# Altium schematic sheet MainBoard_ETH.SchDoc
size 840 x 594 mm; DocumentNumber: VSL.23-MOTHERBOARD; SheetNumber: 3; Format: A1
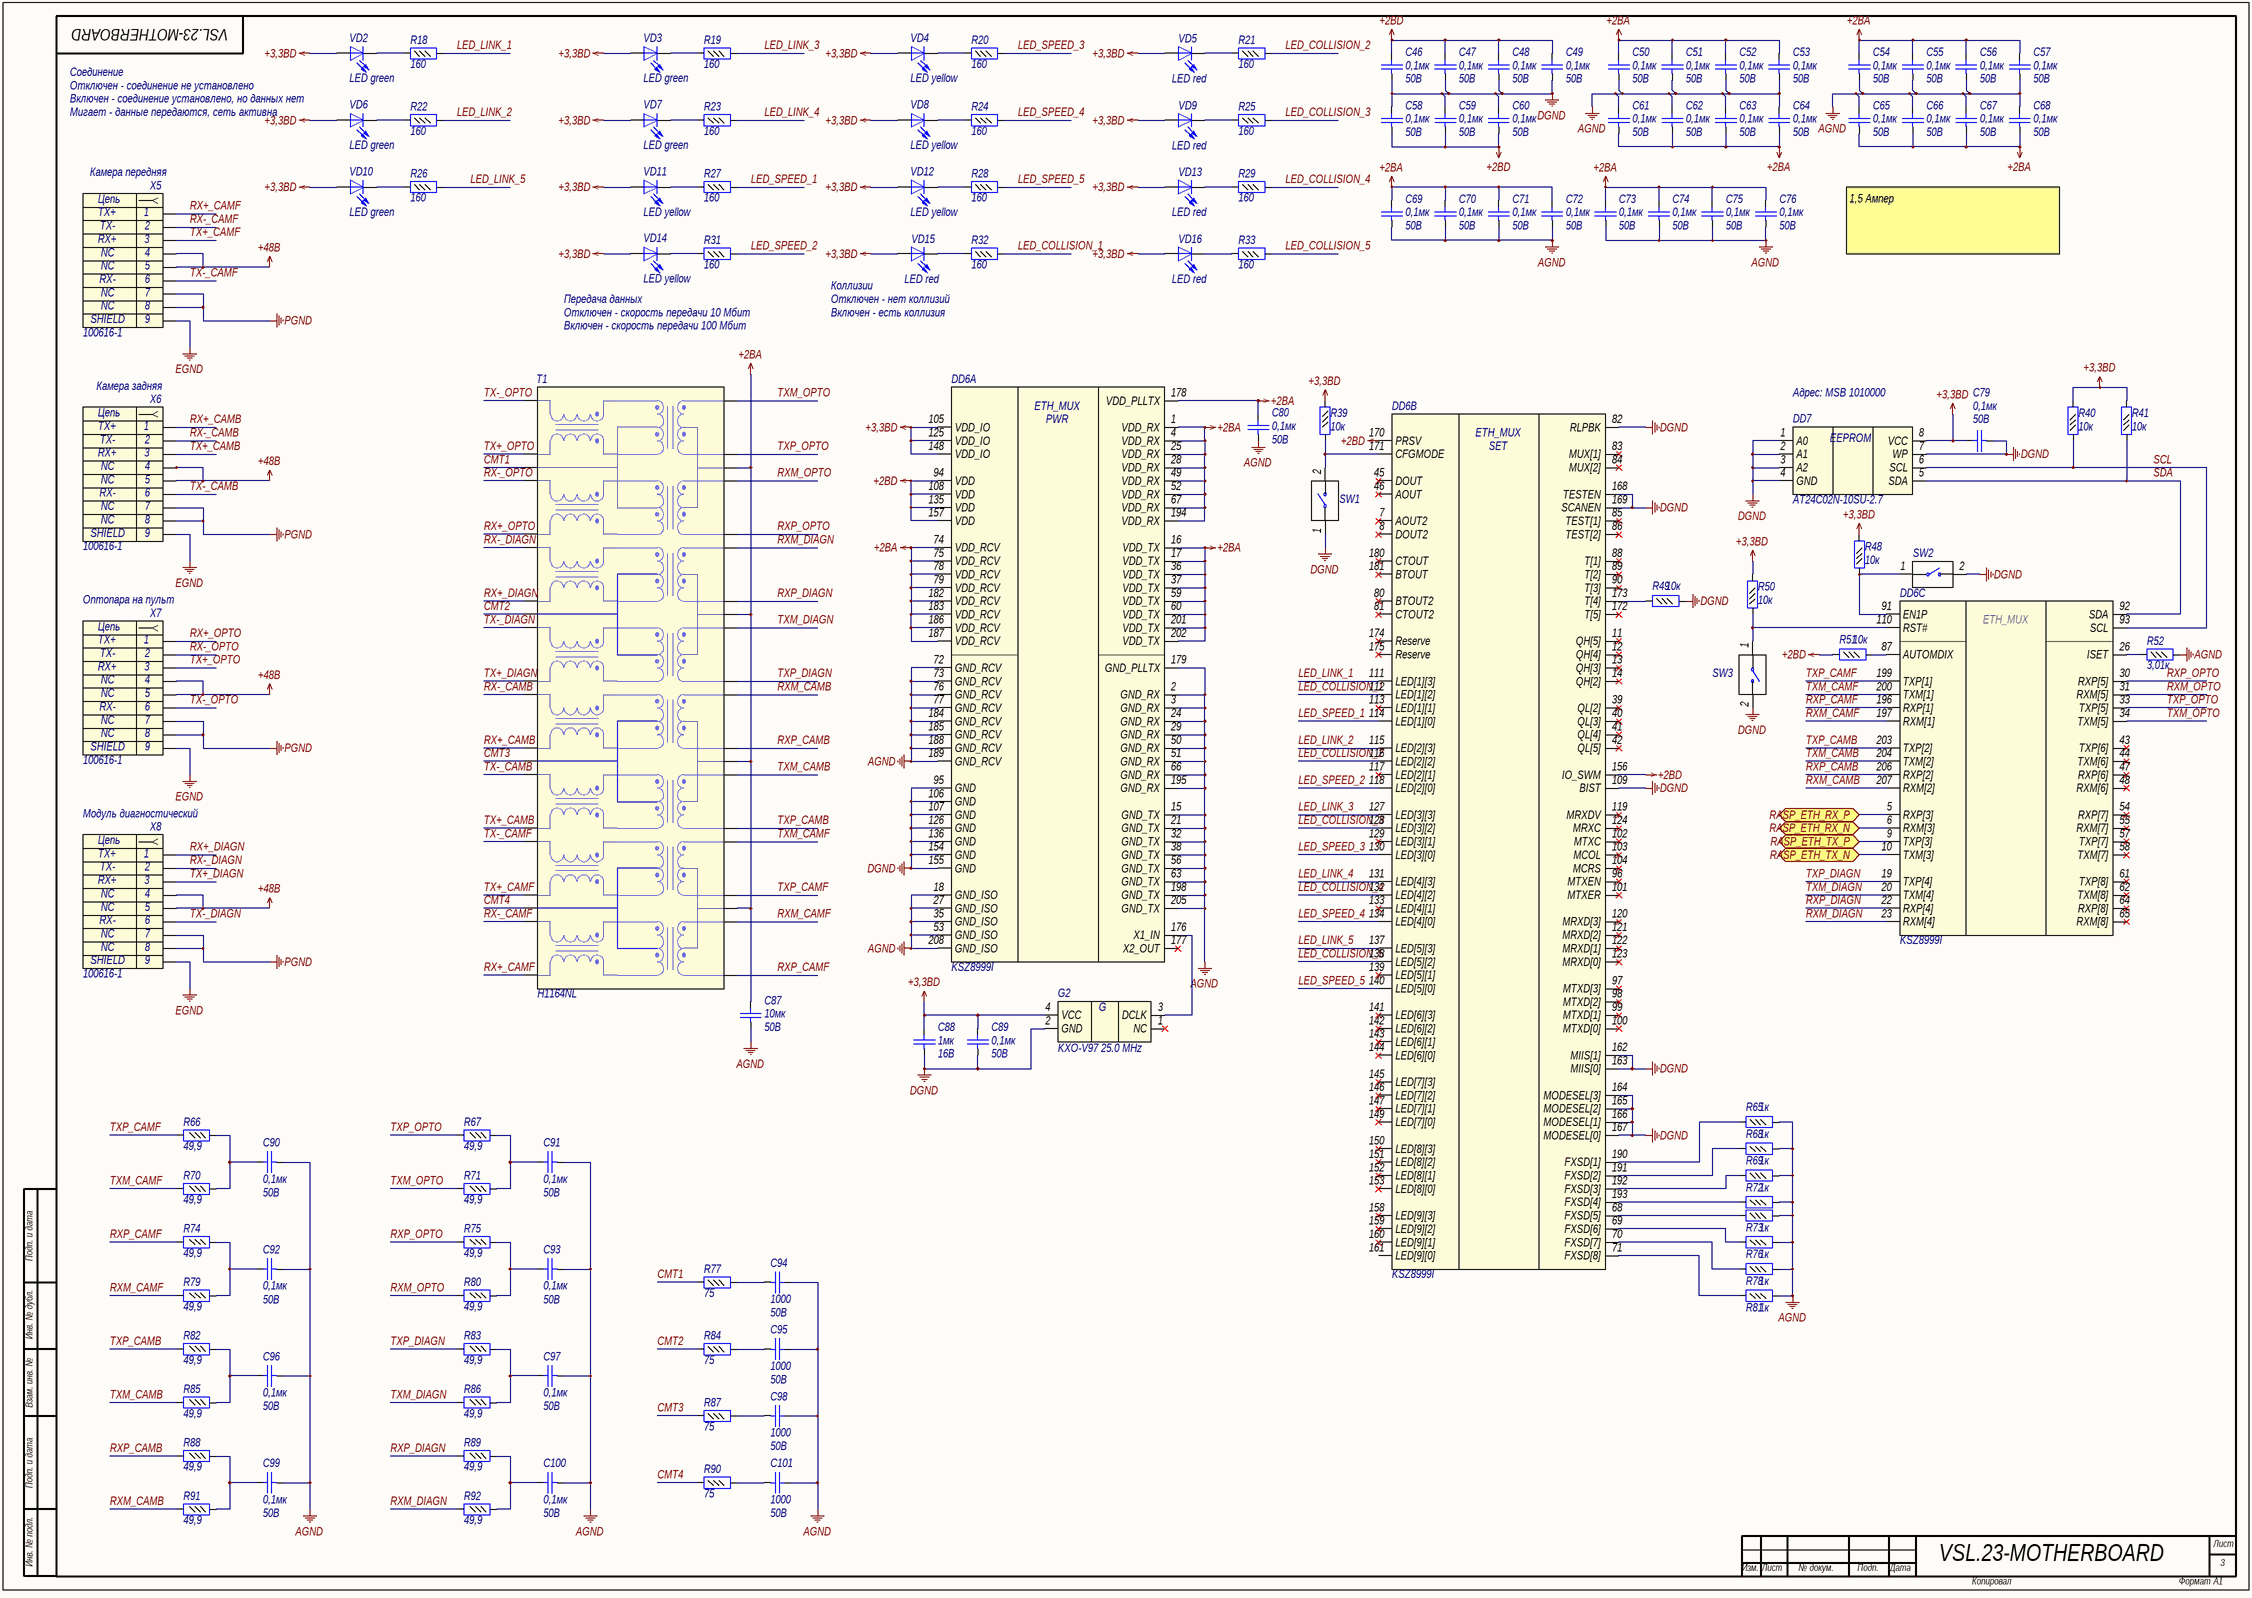
[diagram p0: MainBoard_ETH.SchDoc]

## Parts
C46  value 0,1мк  Voltage: 50В  [C0402]  (hidden comment: Capacitor)
C47  value 0,1мк  Voltage: 50В  [C0402]  (hidden comment: Capacitor)
C48  value 0,1мк  Voltage: 50В  [C0402]  (hidden comment: Capacitor)
C49  value 0,1мк  Voltage: 50В  [C0402]  (hidden comment: Capacitor)
C50  value 0,1мк  Voltage: 50В  [C0402]  (hidden comment: Capacitor)
C51  value 0,1мк  Voltage: 50В  [C0402]  (hidden comment: Capacitor)
C52  value 0,1мк  Voltage: 50В  [C0402]  (hidden comment: Capacitor)
C53  value 0,1мк  Voltage: 50В  [C0402]  (hidden comment: Capacitor)
C54  value 0,1мк  Voltage: 50В  [C0402]  (hidden comment: Capacitor)
C55  value 0,1мк  Voltage: 50В  [C0402]  (hidden comment: Capacitor)
C56  value 0,1мк  Voltage: 50В  [C0402]  (hidden comment: Capacitor)
C57  value 0,1мк  Voltage: 50В  [C0402]  (hidden comment: Capacitor)
C58  value 0,1мк  Voltage: 50В  [C0402]  (hidden comment: Capacitor)
C59  value 0,1мк  Voltage: 50В  [C0402]  (hidden comment: Capacitor)
C60  value 0,1мк  Voltage: 50В  [C0402]  (hidden comment: Capacitor)
C61  value 0,1мк  Voltage: 50В  [C0402]  (hidden comment: Capacitor)
C62  value 0,1мк  Voltage: 50В  [C0402]  (hidden comment: Capacitor)
C63  value 0,1мк  Voltage: 50В  [C0402]  (hidden comment: Capacitor)
C64  value 0,1мк  Voltage: 50В  [C0402]  (hidden comment: Capacitor)
C65  value 0,1мк  Voltage: 50В  [C0402]  (hidden comment: Capacitor)
C66  value 0,1мк  Voltage: 50В  [C0402]  (hidden comment: Capacitor)
C67  value 0,1мк  Voltage: 50В  [C0402]  (hidden comment: Capacitor)
C68  value 0,1мк  Voltage: 50В  [C0402]  (hidden comment: Capacitor)
C69  value 0,1мк  Voltage: 50В  [C0402]  (hidden comment: Capacitor)
C70  value 0,1мк  Voltage: 50В  [C0402]  (hidden comment: Capacitor)
C71  value 0,1мк  Voltage: 50В  [C0402]  (hidden comment: Capacitor)
C72  value 0,1мк  Voltage: 50В  [C0402]  (hidden comment: Capacitor)
C73  value 0,1мк  Voltage: 50В  [C0402]  (hidden comment: Capacitor)
C74  value 0,1мк  Voltage: 50В  [C0402]  (hidden comment: Capacitor)
C75  value 0,1мк  Voltage: 50В  [C0402]  (hidden comment: Capacitor)
C76  value 0,1мк  Voltage: 50В  [C0402]  (hidden comment: Capacitor)
C79  value 0,1мк  Voltage: 50В  [C0402]  (hidden comment: Capacitor)
C80  value 0,1мк  Voltage: 50В  [C0402]  (hidden comment: Capacitor)
C87  Voltage: 50В  [C1210]  (hidden comment: 10мк)
C88  value 1мк  Voltage: 16B  [C0603]  (hidden comment: Capacitor)
C89  value 0,1мк  Voltage: 50В  [C0402]  (hidden comment: Capacitor)
C90  value 0,1мк  Voltage: 50В  [C0402]  (hidden comment: Capacitor)
C91  value 0,1мк  Voltage: 50В  [C0402]  (hidden comment: Capacitor)
C92  value 0,1мк  Voltage: 50В  [C0402]  (hidden comment: Capacitor)
C93  value 0,1мк  Voltage: 50В  [C0402]  (hidden comment: Capacitor)
C94  Voltage: 50B  [C0402]  (hidden comment: 1000)
C95  Voltage: 50B  [C0402]  (hidden comment: 1000)
C96  value 0,1мк  Voltage: 50В  [C0402]  (hidden comment: Capacitor)
C97  value 0,1мк  Voltage: 50В  [C0402]  (hidden comment: Capacitor)
C98  Voltage: 50B  [C0402]  (hidden comment: 1000)
C99  value 0,1мк  Voltage: 50В  [C0402]  (hidden comment: Capacitor)
C100  value 0,1мк  Voltage: 50В  [C0402]  (hidden comment: Capacitor)
C101  Voltage: 50B  [C0402]  (hidden comment: 1000)
DD6  Part Number: KSZ8999I  [PQFP208]  (parts A,B,C of 3)
DD7  Part Number: AT24C02N-10SU-2.7  [SO8]  (hidden comment: AT24C0x)
G2  Part Number: KXO-V97 25.0 MHz  [QSMD7x5.2x1.8]  (hidden comment: KXO)
R18  value 160  [R0402]  (hidden comment: Resistor_0,062Вт)
R19  value 160  [R0402]  (hidden comment: Resistor_0,062Вт)
R20  value 160  [R0402]  (hidden comment: Resistor_0,062Вт)
R21  value 160  [R0402]  (hidden comment: Resistor_0,062Вт)
R22  value 160  [R0402]  (hidden comment: Resistor_0,062Вт)
R23  value 160  [R0402]  (hidden comment: Resistor_0,062Вт)
R24  value 160  [R0402]  (hidden comment: Resistor_0,062Вт)
R25  value 160  [R0402]  (hidden comment: Resistor_0,062Вт)
R26  value 160  [R0402]  (hidden comment: Resistor_0,062Вт)
R27  value 160  [R0402]  (hidden comment: Resistor_0,062Вт)
R28  value 160  [R0402]  (hidden comment: Resistor_0,062Вт)
R29  value 160  [R0402]  (hidden comment: Resistor_0,062Вт)
R31  value 160  [R0402]  (hidden comment: Resistor_0,062Вт)
R32  value 160  [R0402]  (hidden comment: Resistor_0,062Вт)
R33  value 160  [R0402]  (hidden comment: Resistor_0,062Вт)
R39  value 10к  [R0402]  (hidden comment: Resistor_0,062Вт)
R40  value 10к  [R0402]  (hidden comment: Resistor_0,062Вт)
R41  value 10к  [R0402]  (hidden comment: Resistor_0,062Вт)
R48  value 10к  [R0402]  (hidden comment: Resistor_0,062Вт)
R49  value 10к  [R0402]  (hidden comment: Resistor_0,062Вт)
R50  value 10к  [R0402]  (hidden comment: Resistor_0,062Вт)
R51  value 10к  [R0402]  (hidden comment: Resistor_0,062Вт)
R52  value 3,01к  [R0402]  (hidden comment: Resistor_0,062Вт)
R65  value 1к  [R0402]  (hidden comment: Resistor_0,062Вт)
R66  value 49,9  [R0402]  (hidden comment: Resistor_0,062Вт)
R67  value 49,9  [R0402]  (hidden comment: Resistor_0,062Вт)
R68  value 1к  [R0402]  (hidden comment: Resistor_0,062Вт)
R69  value 1к  [R0402]  (hidden comment: Resistor_0,062Вт)
R70  value 49,9  [R0402]  (hidden comment: Resistor_0,062Вт)
R71  value 49,9  [R0402]  (hidden comment: Resistor_0,062Вт)
R72  value 1к  [R0402]  (hidden comment: Resistor_0,062Вт)
R73  value 1к  [R0402]  (hidden comment: Resistor_0,062Вт)
R74  value 49,9  [R0402]  (hidden comment: Resistor_0,062Вт)
R75  value 49,9  [R0402]  (hidden comment: Resistor_0,062Вт)
R76  value 1к  [R0402]  (hidden comment: Resistor_0,062Вт)
R77  value 75  [R0402]  (hidden comment: Resistor_0,062Вт)
R78  value 1к  [R0402]  (hidden comment: Resistor_0,062Вт)
R79  value 49,9  [R0402]  (hidden comment: Resistor_0,062Вт)
R80  value 49,9  [R0402]  (hidden comment: Resistor_0,062Вт)
R81  value 1к  [R0402]  (hidden comment: Resistor_0,062Вт)
R82  value 49,9  [R0402]  (hidden comment: Resistor_0,062Вт)
R83  value 49,9  [R0402]  (hidden comment: Resistor_0,062Вт)
R84  value 75  [R0402]  (hidden comment: Resistor_0,062Вт)
R85  value 49,9  [R0402]  (hidden comment: Resistor_0,062Вт)
R86  value 49,9  [R0402]  (hidden comment: Resistor_0,062Вт)
R87  value 75  [R0402]  (hidden comment: Resistor_0,062Вт)
R88  value 49,9  [R0402]  (hidden comment: Resistor_0,062Вт)
R89  value 49,9  [R0402]  (hidden comment: Resistor_0,062Вт)
R90  value 75  [R0402]  (hidden comment: Resistor_0,062Вт)
R91  value 49,9  [R0402]  (hidden comment: Resistor_0,062Вт)
R92  value 49,9  [R0402]  (hidden comment: Resistor_0,062Вт)
SW1  DS1040-01  [JUMPER_2.54]  (value not drawn)
SW2  DS1040-01  [1PAD_ADR]  (value not drawn)
SW3  DS1040-01  [JUMPER_2.54]  (value not drawn)
T1  Part Number: H1164NL  [H1164NL_TRANS]  (hidden comment: ETH Trasformer)
VD2  Part Name: LED green  [L_0402_GREEN]  (hidden comment: LED)
VD3  Part Name: LED green  [L_0402_GREEN]  (hidden comment: LED)
VD4  Part Name: LED yellow  [L_0402_YELLOW]  (hidden comment: LED)
VD5  Part Name: LED red  [L_0402_RED]  (hidden comment: LED)
VD6  Part Name: LED green  [L_0402_GREEN]  (hidden comment: LED)
VD7  Part Name: LED green  [L_0402_GREEN]  (hidden comment: LED)
VD8  Part Name: LED yellow  [L_0402_YELLOW]  (hidden comment: LED)
VD9  Part Name: LED red  [L_0402_RED]  (hidden comment: LED)
VD10  Part Name: LED green  [L_0402_GREEN]  (hidden comment: LED)
VD11  Part Name: LED yellow  [L_0402_YELLOW]  (hidden comment: LED)
VD12  Part Name: LED yellow  [L_0402_YELLOW]  (hidden comment: LED)
VD13  Part Name: LED red  [L_0402_RED]  (hidden comment: LED)
VD14  Part Name: LED yellow  [L_0402_YELLOW]  (hidden comment: LED)
VD15  Part Name: LED red  [L_0402_RED]  (hidden comment: LED)
VD16  Part Name: LED red  [L_0402_RED]  (hidden comment: LED)
X5  Камера передняя  Part Number: 100616-1  [RJ45_100616-1]
X6  Камера задняя  Part Number: 100616-1  [RJ45_100616-1]
X7  Оптопара на пульт  Part Number: 100616-1  [RJ45_100616-1]
X8  Модуль диагностический  Part Number: 100616-1  [RJ45_100616-1]

## Ports
RASP_ETH_RX_N, RASP_ETH_RX_P, RASP_ETH_TX_N, RASP_ETH_TX_P

## Nets
+2BA: C50.2 C51.2 C52.2 C53.2 C54.2 C55.2 C56.2 C57.2 C61.1 C62.1 C63.1 C64.1 C65.1 C66.1 C67.1 C68.1 C69.2 C70.2 C71.2 C72.2 C73.2 C74.2 C75.2 C76.2 C80.2 C87.2 DD6.1(VDD_RX) DD6.4(VDD_RX) DD6.16(VDD_TX) DD6.17(VDD_TX) DD6.25(VDD_RX) DD6.28(VDD_RX) DD6.36(VDD_TX) DD6.37(VDD_TX) DD6.49(VDD_RX) DD6.52(VDD_RX) DD6.59(VDD_TX) DD6.60(VDD_TX) DD6.67(VDD_RX) DD6.74(VDD_RCV) DD6.75(VDD_RCV) DD6.78(VDD_RCV) DD6.79(VDD_RCV) DD6.178(VDD_PLLTX) DD6.182(VDD_RCV) DD6.183(VDD_RCV) DD6.186(VDD_RCV) DD6.187(VDD_RCV) DD6.194(VDD_RX) DD6.201(VDD_TX) DD6.202(VDD_TX) T1.3(CT4) T1.8(CT3) T1.13(CT2) T1.18(CT1)
+2BD: C46.2 C47.2 C48.2 C49.2 C58.1 C59.1 C60.1 DD6.94(VDD) DD6.108(VDD) DD6.135(VDD) DD6.156(IO_SWM) DD6.157(VDD) DD6.170(PRSV) R51.1
+3,3BD: C79.2 C88.2 C89.2 DD6.105(VDD_IO) DD6.125(VDD_IO) DD6.148(VDD_IO) DD7.8(VCC) G2.4(VCC) R39.1 R40.2 R41.2 R48.2 R50.2 VD2.2(A) VD3.2(A) VD4.2(A) VD5.2(A) VD6.2(A) VD7.2(A) VD8.2(A) VD9.2(A) VD10.2(A) VD11.2(A) VD12.2(A) VD13.2(A) VD14.2(A) VD15.2(A) VD16.2(A)
+48B: X5.4 X5.5 X6.4 X6.5 X7.4 X7.5 X8.4 X8.5
AGND: C50.1 C51.1 C52.1 C53.1 C54.1 C55.1 C56.1 C57.1 C61.2 C62.2 C63.2 C64.2 C65.2 C66.2 C67.2 C68.2 C69.1 C70.1 C71.1 C72.1 C73.1 C74.1 C75.1 C76.1 C80.1 C87.1 C90.1 C91.1 C92.1 C93.1 C94.2 C95.2 C96.1 C97.1 C98.2 C99.1 C100.1 C101.2 DD6.2(GND_RX) DD6.3(GND_RX) DD6.15(GND_TX) DD6.18(GND_ISO) DD6.21(GND_TX) DD6.24(GND_RX) DD6.27(GND_ISO) DD6.29(GND_RX) DD6.32(GND_TX) DD6.35(GND_ISO) DD6.38(GND_TX) DD6.50(GND_RX) DD6.51(GND_RX) DD6.53(GND_ISO) DD6.56(GND_TX) DD6.63(GND_TX) DD6.66(GND_RX) DD6.72(GND_RCV) DD6.73(GND_RCV) DD6.76(GND_RCV) DD6.77(GND_RCV) DD6.179(GND_PLLTX) DD6.184(GND_RCV) DD6.185(GND_RCV) DD6.188(GND_RCV) DD6.189(GND_RCV) DD6.195(GND_RX) DD6.198(GND_TX) DD6.205(GND_TX) DD6.208(GND_ISO) R52.2 R65.2 R68.2 R69.2 R72.2 R73.2 R76.2 R78.2 R81.2
DGND: C46.1 C47.1 C48.1 C49.1 C58.2 C59.2 C60.2 C79.1 C88.1 C89.1 DD6.82(RLPBK) DD6.95(GND) DD6.106(GND) DD6.107(GND) DD6.109(BIST) DD6.126(GND) DD6.136(GND) DD6.154(GND) DD6.155(GND) DD6.162(MIIS[1]) DD6.163(MIIS[0]) DD6.164(MODESEL[3]) DD6.165(MODESEL[2]) DD6.166(MODESEL[1]) DD6.167(MODESEL[0]) DD6.168(TESTEN) DD6.169(SCANEN) DD7.1(A0) DD7.2(A1) DD7.3(A2) DD7.4(GND) DD7.7(WP) G2.2(GND) R49.2 SW1.1 SW2.2 SW3.2
EGND: X5.9 X6.9 X7.9 X8.9
PGND: X5.7 X5.8 X6.7 X6.8 X7.7 X7.8 X8.7 X8.8
CMT1: R77.1 T1.38(CMGND)
CMT2: R84.1 T1.33(CMGND)
CMT3: R87.1 T1.28(CMGND)
CMT4: R90.1 T1.23(CMGND)
LED_COLLISION_1: DD6.112(LED[1][2]) R32.2
LED_COLLISION_2: DD6.116(LED[2][2]) R21.2
LED_COLLISION_3: DD6.128(LED[3][2]) R25.2
LED_COLLISION_4: DD6.132(LED[4][2]) R29.2
LED_COLLISION_5: DD6.138(LED[5][2]) R33.2
LED_LINK_1: DD6.111(LED[1][3]) R18.2
LED_LINK_2: DD6.115(LED[2][3]) R22.2
LED_LINK_3: DD6.127(LED[3][3]) R19.2
LED_LINK_4: DD6.131(LED[4][3]) R23.2
LED_LINK_5: DD6.137(LED[5][3]) R26.2
LED_SPEED_1: DD6.114(LED[1][0]) R27.2
LED_SPEED_2: DD6.118(LED[2][0]) R31.2
LED_SPEED_3: DD6.130(LED[3][0]) R20.2
LED_SPEED_4: DD6.134(LED[4][0]) R24.2
LED_SPEED_5: DD6.140(LED[5][0]) R28.2
RASP_ETH_RX_N: DD6.6(RXM[3]) ; port RASP_ETH_RX_N
RASP_ETH_RX_P: DD6.5(RXP[3]) ; port RASP_ETH_RX_P
RASP_ETH_TX_N: DD6.10(TXM[3]) ; port RASP_ETH_TX_N
RASP_ETH_TX_P: DD6.9(TXP[3]) ; port RASP_ETH_TX_P
RX+_CAMB: T1.29(TX2-) X6.1
RX+_CAMF: T1.21(TX1+) X5.1
RX+_DIAGN: T1.34(RX3+) X8.1
RX+_OPTO: T1.36(RX4-) X7.1
RX-_CAMB: T1.30(TX2+) X6.2
RX-_CAMF: T1.22(TX1-) X5.2
RX-_DIAGN: T1.35(RX3-) X8.2
RX-_OPTO: T1.37(RX4+) X7.2
RXM_CAMB: DD6.207(RXM[2]) R91.2 T1.11(TD2+)
RXM_CAMF: DD6.197(RXM[1]) R79.2 T1.19(TD1-)
RXM_DIAGN: DD6.23(RXM[4]) R92.2 T1.6(RD3-)
RXM_OPTO: DD6.31(RXM[5]) R80.2 T1.4(RD4+)
RXP_CAMB: DD6.206(RXP[2]) R88.2 T1.12(TD2-)
RXP_CAMF: DD6.196(RXP[1]) R74.2 T1.20(TD1+)
RXP_DIAGN: DD6.22(RXP[4]) R89.2 T1.7(RD3+)
RXP_OPTO: DD6.30(RXP[5]) R75.2 T1.5(RD4-)
SCL: DD6.93(SCL) DD7.6(SCL) R40.1
SDA: DD6.92(SDA) DD7.5(SDA) R41.1
TX+_CAMB: T1.26(RX2-) X6.3
TX+_CAMF: T1.24(RX1+) X5.3
TX+_DIAGN: T1.31(TX3+) X8.3
TX+_OPTO: T1.39(TX4-) X7.3
TX-_CAMB: T1.27(RX2+) X6.6
TX-_CAMF: T1.25(RX1-) X5.6
TX-_DIAGN: T1.32(TX3-) X8.6
TX-_OPTO: T1.40(TX4+) X7.6
TXM_CAMB: DD6.204(TXM[2]) R85.2 T1.14(RD2+)
TXM_CAMF: DD6.200(TXM[1]) R70.2 T1.16(RD1-)
TXM_DIAGN: DD6.20(TXM[4]) R86.2 T1.9(TD3-)
TXM_OPTO: DD6.34(TXM[5]) R71.2 T1.1(TD4+)
TXP_CAMB: DD6.203(TXP[2]) R82.2 T1.15(RD2-)
TXP_CAMF: DD6.199(TXP[1]) R66.2 T1.17(RD1+)
TXP_DIAGN: DD6.19(TXP[4]) R83.2 T1.10(TD3+)
TXP_OPTO: DD6.33(TXP[5]) R67.2 T1.2(TD4-)
NetC90_2: C90.2 R66.1 R70.1
NetC91_2: C91.2 R67.1 R71.1
NetC92_2: C92.2 R74.1 R79.1
NetC93_2: C93.2 R75.1 R80.1
NetC94_1: C94.1 R77.2
NetC95_1: C95.1 R84.2
NetC96_2: C96.2 R82.1 R85.1
NetC97_2: C97.2 R83.1 R86.1
NetC98_1: C98.1 R87.2
NetC99_2: C99.2 R88.1 R91.1
NetC100_2: C100.2 R89.1 R92.1
NetC101_1: C101.1 R90.2
NetDD6_26: DD6.26(ISET) R52.1
NetDD6_68: DD6.68(FXSD[5]) R73.1
NetDD6_69: DD6.69(FXSD[6]) R76.1
NetDD6_70: DD6.70(FXSD[7]) R78.1
NetDD6_71: DD6.71(FXSD[8]) R81.1
NetDD6_87: DD6.87(AUTOMDIX) R51.2
NetDD6_91: DD6.91(EN1P) R48.1 SW2.1
NetDD6_110: DD6.110(RST#) R50.1 SW3.1
NetDD6_171: DD6.171(CFGMODE) R39.2 SW1.2
NetDD6_173: DD6.173(T[4]) R49.1
NetDD6_176: DD6.176(X1_IN) G2.3(DCLK)
NetDD6_190: DD6.190(FXSD[1]) R65.1
NetDD6_191: DD6.191(FXSD[2]) R68.1
NetDD6_192: DD6.192(FXSD[3]) R69.1
NetDD6_193: DD6.193(FXSD[4]) R72.1
NetR18_1: R18.1 VD2.1(K)
NetR19_1: R19.1 VD3.1(K)
NetR20_1: R20.1 VD4.1(K)
NetR21_1: R21.1 VD5.1(K)
NetR22_1: R22.1 VD6.1(K)
NetR23_1: R23.1 VD7.1(K)
NetR24_1: R24.1 VD8.1(K)
NetR25_1: R25.1 VD9.1(K)
NetR26_1: R26.1 VD10.1(K)
NetR27_1: R27.1 VD11.1(K)
NetR28_1: R28.1 VD12.1(K)
NetR29_1: R29.1 VD13.1(K)
NetR31_1: R31.1 VD14.1(K)
NetR32_1: R32.1 VD15.1(K)
NetR33_1: R33.1 VD16.1(K)

Not connected (* = marked no-connect by the designer): DD6 7(AOUT2)* 8(DOUT2)* 11(QH[5])* 12(QH[4])* 13(QH[3])* 14(QH[2])* 39(QL[2])* 40(QL[3])* 41(QL[4])* 42(QL[5])* 43(TXP[6])* 44(TXM[6])* 45(DOUT)* 46(AOUT)* 47(RXP[6])* 48(RXM[6])* 54(RXP[7])* 55(RXM[7])* 57(TXP[7])* 58(TXM[7])* 61(TXP[8])* 62(TXM[8])* 64(RXP[8])* 65(RXM[8])* 80(BTOUT2)* 81(CTOUT2)* 83(MUX[1])* 84(MUX[2])* 85(TEST[1])* 86(TEST[2])* 88(T[1])* 89(T[2])* 90(T[3])* 96(MTXEN)* 97(MTXD[3])* 98(MTXD[2])* 99(MTXD[1])* 100(MTXD[0])* 101(MTXER)* 102(MTXC)* 103(MCOL)* 104(MCRS)* 113(LED[1][1])* 117(LED[2][1])* 119(MRXDV)* 120(MRXD[3])* 121(MRXD[2])* 122(MRXD[1])* 123(MRXD[0])* 124(MRXC)* 129(LED[3][1])* 133(LED[4][1])* 139(LED[5][1])* 141(LED[6][3])* 142(LED[6][2])* 143(LED[6][1])* 144(LED[6][0])* 145(LED[7][3])* 146(LED[7][2])* 147(LED[7][1])* 149(LED[7][0])* 150(LED[8][3])* 151(LED[8][2])* 152(LED[8][1])* 153(LED[8][0])* 158(LED[9][3])* 159(LED[9][2])* 160(LED[9][1])* 161(LED[9][0]) 172(T[5])* 174(Reserve)* 175(Reserve)* 177(X2_OUT)* 180(CTOUT)* 181(BTOUT)*; G2 1(NC)*

## Notes on the sheet
- Соединение
- Отключен - соединение не установлено
- (near VD6) Включен - соединение установлено, но данных нет
- Мигает - данные передаются, сеть активна
- 1,5 Ампер
- Передача данных
- Коллизии
- Отключен - нет коллизий
- Отключен - скорость передачи 10 Мбит
- Включен - скорость передачи 100 Мбит
- Включен - есть коллизия
- Адрес: MSB 1010000
- Подп. и дата
- Инв. № дубл.
- Взам. инв. №
- Инв. № подл.
- Лист
- Изм.
- № докум.
- Подп.
- Дата
- Копировал
- Формат
- (in symbol connect111) Цепь
- (in symbol crystal9) G
- (in symbol interf24, part A) ETH_MUX; PWR
- (in symbol interf24, part B) ETH_MUX; SET
- (in symbol interf24, part C) ETH_MUX

## Library data of the parts
C46-C76 C79 C80 C89-C93 C96 C97 C99 C100 = cap277: Конденсатор; Part Name: Ceramic; Manufacture: Murata; Part Number: GRM155R71H104KE14D; id: cap277; TKE: X7R; tga: 0,10%
C87 = cap297: Конденсатор; Part Name: MLCC; Manufacture: TDK; Part Number: C3225X7R1H106K250AC; id: cap297; TKE: X7R; tga: 0,10%; Value: 10мк
C88 = cap133: Конденсатор; Part Name: Ceramic; Manufacture: Murata; Part Number: GRM188R71C105KA12D**; id: cap133; TKE: X7R
C94 C95 C98 C101 = cap31: Конденсатор; Part Name: Ceramic; Manufacture: Murata; Part Number: GRM155R71H102K*; id: cap31; TKE: X7R; Value: 1000
DD6 = interf24: 9-Port 10/100 Unmanaged Ethernet Switch; Manufacture: Microchip; Type Supply: Single Polar; Current Consumption: 4,34A; Power Supply: 2 В; id: interf24; Part Name: 9-Port 10/100 Unmanaged Ethernet Switch
DD7 = AT24C02N-10SU-2.7: Two-wire  Serial EEPROM; Manufacturer: Microchip; id: mem2; Frequency: 400kHz; Access Time: 900ns; Write Time: 5ms; Memory Size: 2Kbit; Interface: i2c; Power Supply: 2.7-5.5 V; Part Name: EEPROM
G2 = crystal9: Кварц. генер. 32.768 МГц (HCMOS/TTL); Manufacture: GEYER; Frequence: 25MHz; Power Supply: 3,3B; Tempreture MIN: -20°С; Tempreture MAX: +70°С; id: crystal9
R18-R29 R31-R33 = res251: Резистор; Manufacture: Yageo; Part Number: RC0402FR-07160RL; id: res251; Accuracy: 0,01; Part Name: Resistor; Power: 0,062Вт
R39-R41 R48-R51 = res294: Резистор; Manufacture: Yageo; Part Number: RC0402FR-0710KL; id: res294; Accuracy: 0,01; Part Name: Resistor; Power: 0,062Вт
R52 = res1212: Резистор; Manufacture: Yageo; Part Number: RC0402FR-073K01L; Accuracy: 0,01; id: res1212; Part Name: Resistor; Power: 0,062Вт
R65 R68 R69 R72 R73 R76 R78 R81 = res270: Резистор; Manufacture: Yageo; Part Number: RC0402FR-071KL; id: res270; Accuracy: 0,01; Part Name: Resistor; Power: 0,062Вт
R66 R67 R70 R71 R74 R75 R79 R80 R82 R83 R85 R86 R88 R89 R91 R92 = res984: Резистор; Manufacture: Yageo; Part Number: RC0402FR-0749R9L; id: res984; Accuracy: 0,01; Part Name: Resistor; Power: 0,062Вт
R77 R84 R87 R90 = res243: Резистор; Manufacture: Yageo; Part Number: RC0402FR-0775RL; id: res243; Accuracy: 0,01; Part Name: Resistor; Power: 0,062Вт
SW1 SW3 = btn9: DIP переключатель; Part Name: Перемычка адреса; id: btn9; Etch: 2,54
SW2 = btn7: DIP переключатель; Part Name: Перемычка адреса; id: btn7
T1 = ind174: EMI Suppression Filter; Part Name: 10/100Base-TX Transformer Modules; Manufacture: Pulse Electronics; id: ind174
VD2 VD3 VD6 VD7 VD10 = diode30: Светодиод; Part Number: KPHHS-1005MGCK; id: diode30
VD4 VD8 VD11 VD12 VD14 = diode29: Светодиод; Part Number: KPHHS-1005SYCK; id: diode29
VD5 VD9 VD13 VD15 VD16 = diode28: Светодиод; Part Number: KPHHS-1005SURCK; id: diode28
X5-X8 = connect111: Разъем - 9 конт. розетка; Part Name: Conn RJ-45 F 8; Manufacture: TE Connectivity; Contact_1: TX+; Contact_2: TX-; Contact_3: RX+; Contact_4: NC; Contact_6: RX-; Etch: 2.54mm; Contact_9: SHIELD; Contact_5: NC; id: connect111; Contact_7: NC; Contact_8: NC